# Altium schematic sheet RcMPPT-Supply.SchDoc: RcMPPT-Supply
size A4; Author: Thomas Hofmann; CompanyName: HTL St. Pölten; Organization: Altium Limited; Address1: RcMPPT; Address2: Frenchs Forest; Address3: NSW; Address4: Australia 2086; DocumentNumber: 7; Revision: 2.0; SheetNumber: 7; SheetTotal: 8
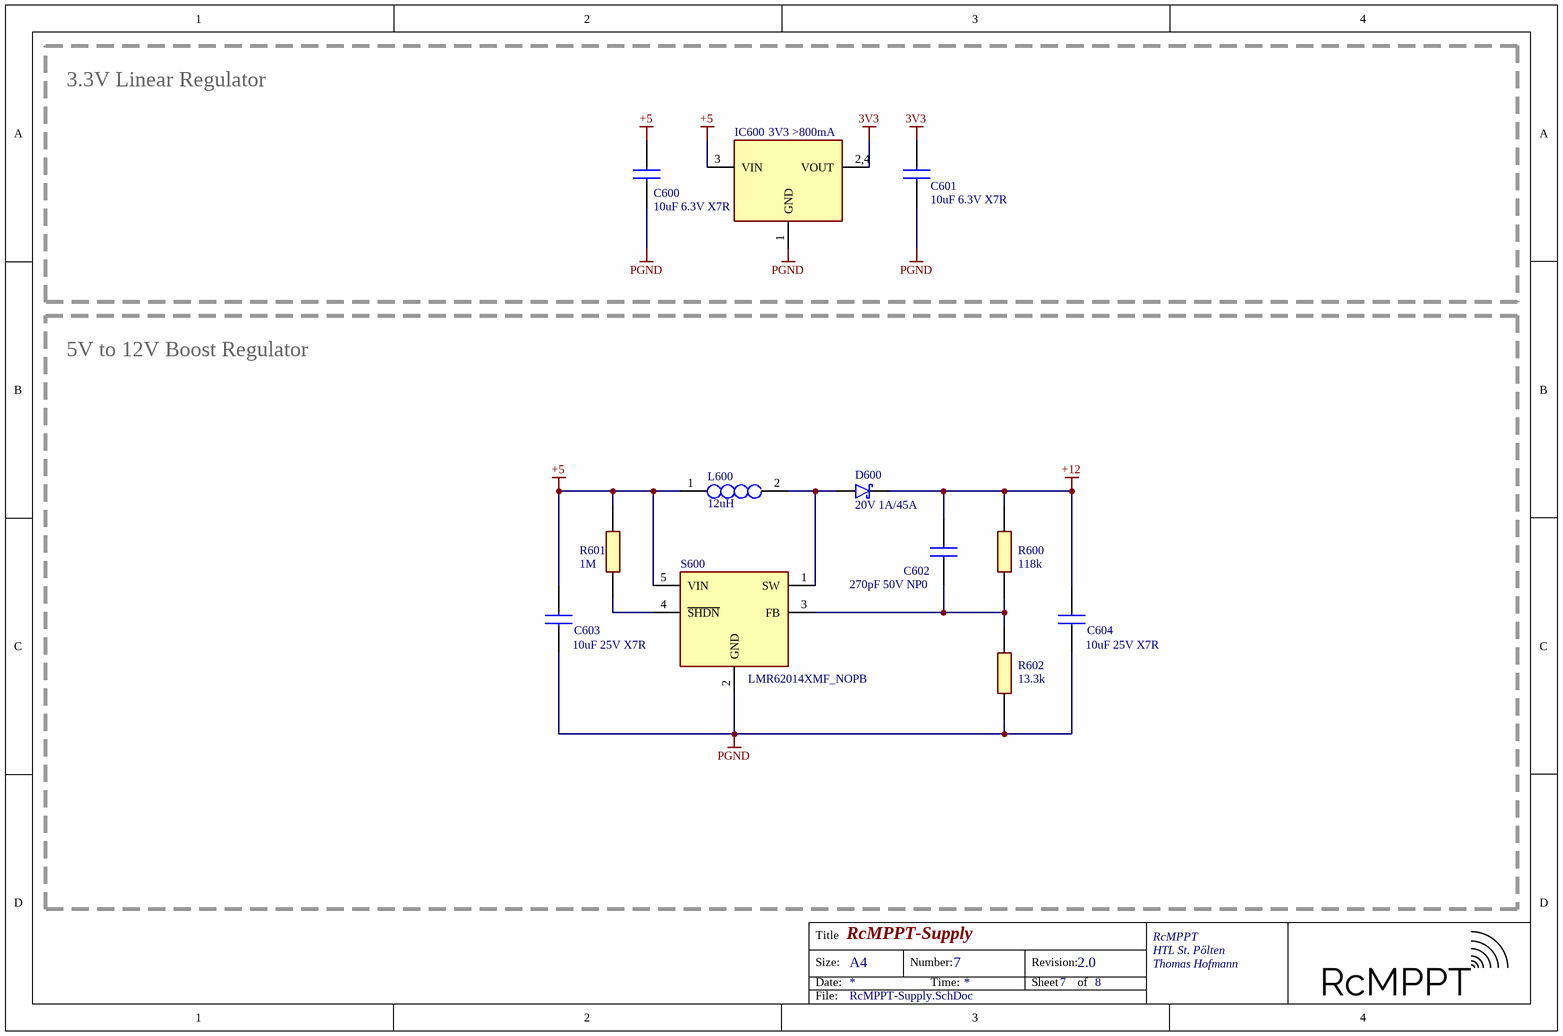
[diagram p0: RcMPPT-Supply.SchDoc]

## Parts
C600  10uF 6.3V X7R  [CAPC3216X180N]
C601  10uF 6.3V X7R  [CAPC3216X180N]
C602  270pF 50V NP0  [CAPC1608X97N]
C603  10uF 25V X7R  [CAPC3225X270N]
C604  10uF 25V X7R  [CAPC3225X270N]
D600  20V 1A/45A  [SOD-123FL]
IC600  3V3 >800mA  [SOT230P700X180-4N]
L600  12uH  [INDPM4141X310N]
R600  118k  [RESC1608X50N]
R601  1M  [RESC1608X50N]
R602  13.3k  [RESC1608X50N]
S600  LMR62014XMF_NOPB  [SOT95P280X145-5N]

## Blocks framed on the sheet
3.3V Linear Regulator: C600 C601 IC600
5V to 12V Boost Regulator: C602-C604 D600 L600 R600-R602 S600

## Nets
3V3: C601.2 IC600.2,4(VOUT)
+5: C600.2 C603.1 IC600.3(VIN) L600.1 R601.2 S600.5(VIN)
+12: C602.1 C604.1 D600.1(K) R600.1
PGND: C600.1 C601.1 C603.2 C604.2 IC600.1(GND) R602.2 S600.2(GND)
NetC602_2: C602.2 R600.2 R602.1 S600.3(FB)
NetD600_2: D600.2(A) L600.2 S600.1(SW)
NetR601_1: R601.1 S600.4(~{SHDN})

## Notes on the sheet
- Title
- Size:
- Date:
- A4
- Number:
- Time:
- Revision:
- Sheet
- of
- RcMPPT
- File:

## Library data of the parts
C600 C601 = C1206: Capacitor; Height: 1.8mm
C602 = C0603: Capacitor; Height: 0.97
C603 C604 = C1210: Capacitor; Height: 0.97mm
D600 = SCHOTTKY-DIODE: Schottky Diode
IC600 = LDO-SOT223: LDO
L600 = 78438357100: Inductor; Manufacturer_Name: Wurth Elektronik; Datasheet Link: https://katalog.we-online.de/pbs/datasheet/78438357100.pdf; Height: 3.1mm; Manufacturer_Part_Number: 78438357100; Mouser Part Number: 710-78438357100; Mouser Price/Stock: https://www.mouser.co.uk/ProductDetail/Wurth-Elektronik/78438357100?qs=f9yNj16SXrI9saR5LXmRyQ%3D%3D
R600-R602 = R0603: Resistor; Height: 0.55mm
S600 = LMR62014XMF_NOPB: Switch; Manufacturer_Name: Texas Instruments; Manufacturer_Part_Number: LMR62014XMF/NOPB; Datasheet Link: http://www.ti.com/lit/gpn/lmr62014; Height: 1.45mm; Mouser Part Number: 926-LMR62014XMF/NOPB; Mouser Price/Stock: https://www.mouser.co.uk/ProductDetail/Texas-Instruments/LMR62014XMF-NOPB?qs=cN01o9PeIQtA177Vn0GXdQ%3D%3D; Arrow Part Number: LMR62014XMF/NOPB; Arrow Price/Stock: https://www.arrow.com/en/products/lmr62014xmfnopb/texas-instruments